# EAGLE schematic untitled (EAGLE 9.6.2)
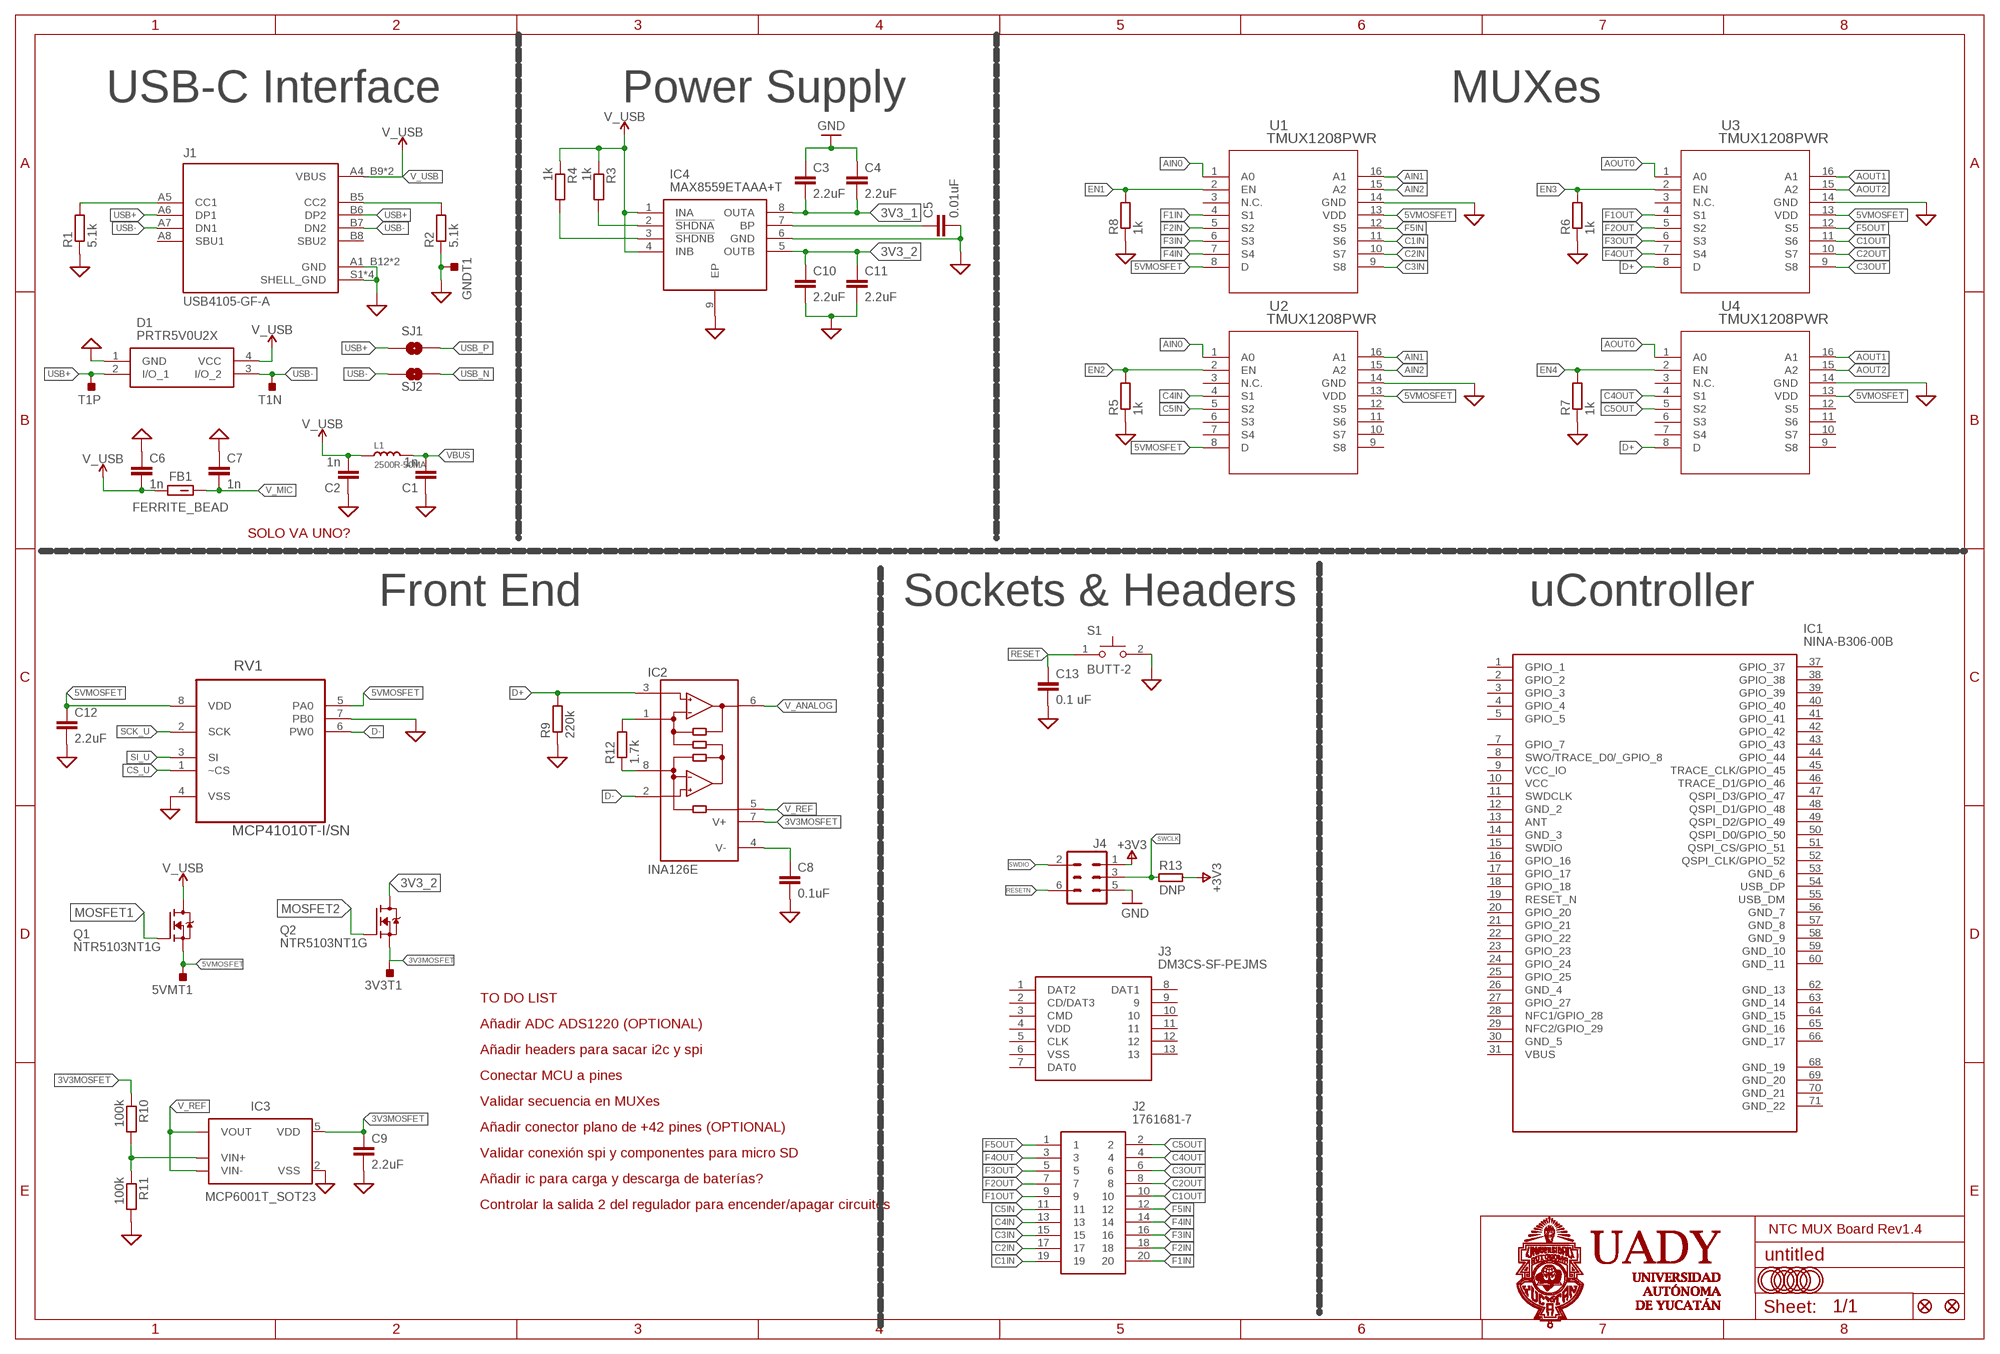
[diagram p0: schematic, sheet 1]

## Parts
3V3T1  TESTPOINT_TPS-SMD-10SN  [TESTPOINT_SMD-10SN]
5VMT1  TESTPOINT_TPS-SMD-10SN  [TESTPOINT_SMD-10SN]
C1  1n  C-EUC0603  [C0603]
C2  1n  C-EUC0603  [C0603]
C3  2.2uF  C-EUC0603  [C0603]
C4  2.2uF  C-EUC0603  [C0603]
C5  0.01uF  C-EUC0603  [C0603]
C6  1n  C-EUC0603  [C0603]
C7  1n  C-EUC0603  [C0603]
C8  0.1uF  C-EUC0603  [C0603]
C9  2.2uF  C-EUC0603  [C0603]
C10  2.2uF  C-EUC0603  [C0603]
C11  2.2uF  C-EUC0603  [C0603]
C12  2.2uF  C-EUC0603  [C0603]
C13  0.1 uF  C-EUC0603  [C0603]
D1  PRTR5V0U2X  [PRTR5V0U2X]
FB1  FERRITE_BEAD  FBCHIP-0603(1608-METRIC)  [BEADC1608X95N]
FID1  FIDUCIAL_1MM  [FIDUCIAL_1MM]
FID4  FIDUCIAL_1MM  [FIDUCIAL_1MM]
GNDT1  TESTPOINT_TPS-SMD-10SN  [TESTPOINT_SMD-10SN]
IC1  NINA-B306-00B  [NINAB30600B]
IC2  INA126E  [MSOP08]
IC3  MCP6001T_SOT23  [SOT95P280X145-5N]
IC4  MAX8559ETAAA+T  [SON65P300X300X80-9N]
J1  USB4105-GF-A  [GCT_USB4105-GF-A]
J2  1761681-7  [SHDR20W66P254_2X10_3302X883X92]
J3  DM3CS-SF-PEJMS  [DM3CSSFPEJMS]
J4  DNP  PINHD-2X03(NO4)  [2X03-TP1]
L1  2500R-50MA  SMD-FERRITE-BEAD-2500R-50MA(0603)  [L0603]
Q1  NTR5103NT1G  [SOT95P237X111-3N]
Q2  NTR5103NT1G  [SOT95P237X111-3N]
R1  5.1k  R-EU_R0603  [R0603]
R2  5.1k  R-EU_R0603  [R0603]
R3  1k  R-EU_R0603  [R0603]
R4  1k  R-EU_R0603  [R0603]
R5  1k  R-EU_R0603  [R0603]
R6  1k  R-EU_R0603  [R0603]
R7  1k  R-EU_R0603  [R0603]
R8  1k  R-EU_R0603  [R0603]
R9  220k  R-EU_R0603  [R0603]
R10  100k  R-EU_R0603  [R0603]
R11  100k  R-EU_R0603  [R0603]
R12  1.7k  R-EU_R0603  [R0603]
R13  DNP  R-DNP-0402  [0402-1005X55N]
RV1  MCP41010T-I/SN  [SOIC127P600X175-8N]
S1  BUTT-2  [SW_BUTT-2]
SJ1  JUMPER-SMT_2_NO_NO-SILK  [SMT-JUMPER_2_NO_NO-SILK]
SJ2  JUMPER-SMT_2_NO_NO-SILK  [SMT-JUMPER_2_NO_NO-SILK]
T1N  TESTPOINT_TPS-SMD-10SN  [TESTPOINT_SMD-10SN]
T1P  TESTPOINT_TPS-SMD-10SN  [TESTPOINT_SMD-10SN]
U1  TMUX1208PWR  [PW_16_TEX]
U2  TMUX1208PWR  [PW_16_TEX]
U3  TMUX1208PWR  [PW_16_TEX]
U4  TMUX1208PWR  [PW_16_TEX]
U$2  MOUNTINGHOLE2.5  [MOUNTINGHOLE_2.5_PLATED]
U$3  MOUNTINGHOLE2.5  [MOUNTINGHOLE_2.5_PLATED]
U$4  MOUNTINGHOLE2.5  [MOUNTINGHOLE_2.5_PLATED]
U$24  MOUNTINGHOLE2.5  [MOUNTINGHOLE_2.5_PLATED]

## Nets
3V3_1: C3.2 C4.2 IC4.8(OUTA)
3V3_2: C10.1 C11.1 IC4.5(OUTB) Q2.3(D)
3V3MOSFET: 3V3T1.TP C9.1 IC2.7(V+) IC3.5(VDD) Q2.2(S) R10.1
5VMOSFET: 5VMT1.TP C12.1 Q1.2(S) RV1.5(PA0) RV1.8(VDD) U1.8(D) U1.13(VDD) U2.8(D) U2.13(VDD) U3.13(VDD) U4.13(VDD)
+3V3: J4.1 R13.1
AIN0: U1.1(A0) U2.1(A0)
AIN1: U1.16(A1) U2.16(A1)
AIN2: U1.15(A2) U2.15(A2)
AOUT0: U3.1(A0) U4.1(A0)
AOUT1: U3.16(A1) U4.16(A1)
AOUT2: U3.15(A2) U4.15(A2)
C1IN: J2.19 U1.11(S6)
C1OUT: J2.10 U3.11(S6)
C2IN: J2.17 U1.10(S7)
C2OUT: J2.8 U3.10(S7)
C3IN: J2.15 U1.9(S8)
C3OUT: J2.6 U3.9(S8)
C4IN: J2.13 U2.4(S1)
C4OUT: J2.4 U4.4(S1)
C5IN: J2.11 U2.5(S2)
C5OUT: J2.2 U4.5(S2)
CS_U: RV1.1(~CS)
D+: IC2.3(+IN) R9.2 U3.8(D) U4.8(D)
D-: IC2.2(-IN) RV1.6(PW0)
EN1: R8.2 U1.2(EN)
EN2: R5.2 U2.2(EN)
EN3: R6.2 U3.2(EN)
EN4: R7.2 U4.2(EN)
F1IN: J2.20 U1.4(S1)
F1OUT: J2.9 U3.4(S1)
F2IN: J2.18 U1.5(S2)
F2OUT: J2.7 U3.5(S2)
F3IN: J2.16 U1.6(S3)
F3OUT: J2.5 U3.6(S3)
F4IN: J2.14 U1.7(S4)
F4OUT: J2.3 U3.7(S4)
F5IN: J2.12 U1.12(S5)
F5OUT: J2.1 U3.12(S5)
GND: C1.1 C2.1 C3.1 C4.1 C5.2 C6.1 C7.1 C8.2 C9.2 C10.2 C11.2 C12.2 C13.2 D1.1(GND) GNDT1.TP IC3.2(VSS) IC4.6(GND) IC4.9(EP) J1.A1_B12(GND) J1.B1_A12(GND) J1.S1(SHELL_GND) J1.S2(SHELL_GND) J1.S3(SHELL_GND) J1.S4(SHELL_GND) J4.5 R1.1 R2.1 R5.1 R6.1 R7.1 R8.1 R9.1 R11.2 RV1.4(VSS) RV1.7(PB0) S1.2 U1.14(GND) U2.14(GND) U3.14(GND) U4.14(GND) ; supply symbol labelled SUP
MOSFET1: Q1.1(G)
MOSFET2: Q2.1(G)
N$1: J1.A5(CC1) R1.2
N$2: IC4.2(!SHDNA) R3.2
N$3: IC4.3(!SHDNB) R4.2
N$4: IC2.1(RG) R12.2
N$5: C5.1 IC4.7(BP)
N$6: IC2.8(RG) R12.1
N$7: C8.1 IC2.4(V-)
N$8: J1.B5(CC2) R2.2
N$9: IC3.3(VIN+) R10.2 R11.1
RESET: C13.1 S1.1
RESETN: J4.6
SCK_U: RV1.2(SCK)
SI_U: RV1.3(SI)
SWCLK: J4.3 R13.2
SWDIO: J4.2
USB+: D1.2(I/O_1) J1.A6(DP1) J1.B6(DP2) SJ1.1 T1P.TP
USB-: D1.3(I/O_2) J1.A7(DN1) J1.B7(DN2) SJ2.1 T1N.TP
USB_N: SJ2.2
USB_P: SJ1.2
V_ANALOG: IC2.6(OUT)
V_MIC: C7.2 FB1.2
V_REF: IC2.5(REF) IC3.1(VOUT) IC3.4(VIN-)
V_USB: C2.2 C6.2 D1.4(VCC) FB1.1 IC4.1(INA) IC4.4(INB) J1.A4_B9(VBUS) J1.B4_A9(VBUS) L1.1 Q1.3(D) R3.1 R4.1
VBUS: C1.2 L1.2
Unconnected: IC1.1(GPIO_1) IC1.2(GPIO_2) IC1.3(GPIO_3) IC1.4(GPIO_4) IC1.5(GPIO_5) IC1.7(GPIO_7) IC1.8(SWO/TRACE_D0/_GPIO_8) IC1.9(VCC_IO) IC1.10(VCC) IC1.11(SWDCLK) IC1.12(GND_2) IC1.13(ANT) IC1.14(GND_3) IC1.15(SWDIO) IC1.16(GPIO_16) IC1.17(GPIO_17) IC1.18(GPIO_18) IC1.19(RESET_N) IC1.20(GPIO_20) IC1.21(GPIO_21) IC1.22(GPIO_22) IC1.23(GPIO_23) IC1.24(GPIO_24) IC1.25(GPIO_25) IC1.26(GND_4) IC1.27(GPIO_27) IC1.28(NFC1/GPIO_28) IC1.29(NFC2/GPIO_29) IC1.30(GND_5) IC1.31(VBUS) IC1.37(GPIO_37) IC1.38(GPIO_38) IC1.39(GPIO_39) IC1.40(GPIO_40) IC1.41(GPIO_41) IC1.42(GPIO_42) IC1.43(GPIO_43) IC1.44(GPIO_44) IC1.45(TRACE_CLK/GPIO_45) IC1.46(TRACE_D1/GPIO_46) IC1.47(QSPI_D3/GPIO_47) IC1.48(QSPI_D1/GPIO_48) IC1.49(QSPI_D2/GPIO_49) IC1.50(QSPI_D0/GPIO_50) IC1.51(QSPI_CS/GPIO_51) IC1.52(QSPI_CLK/GPIO_52) IC1.53(GND_6) IC1.54(USB_DP) IC1.55(USB_DM) IC1.56(GND_7) IC1.57(GND_8) IC1.58(GND_9) IC1.59(GND_10) IC1.60(GND_11) IC1.62(GND_13) IC1.63(GND_14) IC1.64(GND_15) IC1.65(GND_16) IC1.66(GND_17) IC1.68(GND_19) IC1.69(GND_20) IC1.70(GND_21) IC1.71(GND_22) J1.A8(SBU1) J1.B8(SBU2) J3.1(DAT2) J3.2(CD/DAT3) J3.3(CMD) J3.4(VDD) J3.5(CLK) J3.6(VSS) J3.7(DAT0) J3.8(DAT1) J3.9 J3.10 J3.11 J3.12 J3.13 U1.3(N.C.) U2.3(N.C.) U2.6(S3) U2.7(S4) U2.9(S8) U2.10(S7) U2.11(S6) U2.12(S5) U3.3(N.C.) U4.3(N.C.) U4.6(S3) U4.7(S4) U4.9(S8) U4.10(S7) U4.11(S6) U4.12(S5)

## Notes on the sheet
- USB-C Interface | Power Supply | MUXes
- SOLO VA UNO?
- Front End | Sockets & Headers | uController
- TO DO LIST
- Añadir ADC ADS1220 (OPTIONAL)
- Añadir headers para sacar i2c y spi
- Conectar MCU a pines
- Validar secuencia en MUXes
- Añadir conector plano de +42 pines (OPTIONAL)
- Validar conexión spi y componentes para micro SD
- Añadir ic para carga y descarga de baterías?
- Controlar la salida 2 del regulador para encender/apagar circuitos
- NTC MUX Board Rev1.4

## Library data of the parts
3V3T1 5VMT1 GNDT1 T1N T1P = 52101-101-REV-A_v16:TESTPOINT_TPS: TEST POINT PAD; BOM: EXCLUDE
C1-C13 = rcl:C-EU: CAPACITOR, European symbol; SPICEPREFIX: C
D1 = PRTR5V0U2X:PRTR5V0U2X: NEXPERIA - PRTR5V0U2X - DIODE, TVS, DUAL, SOT-143B Source: Datasheet <https://assets.nexperia.com/documents/data-sheet/PRTR5V0U2X.pdf>; DESCRIPTION: NEXPERIA - PRTR5V0U2X - DIODE, TVS, DUAL, SOT-143B; HEIGHT: 1.1mm; MANUFACTURER_NAME: Nexperia; MANUFACTURER_PART_NUMBER: PRTR5V0U2X; MOUSER_PART_NUMBER: N/A; MOUSER_PRICE-STOCK: https://www.mouser.co.uk/ProductDetail/Nexperia/PRTR5V0U2X?qs=vHuUswq2%252BsxqVTVM0kNyWw%3D%3D
FB1 = Filter:FB: Ferrite Bead - Generic; CATEGORY: Filter; SUB-CATEGORY: Ferrite bead
FID1 FID4 = microbuilder:FIDUCIAL: Fiducial Alignment Points Various fiducial points for machine vision alignment.; BOM: EXCLUDE
IC1 = NINA-B306-00B:NINA-B306-00B: RX TXRX MODULE BT TRC ANT SMD Source: Datasheet <https://www.u-blox.com/en/docs/UBX-17052099>; DESCRIPTION: RX TXRX MODULE BT TRC ANT SMD; HEIGHT: 2.63mm; MANUFACTURER_NAME: U-Blox; MANUFACTURER_PART_NUMBER: NINA-B306-00B; MOUSER_PART_NUMBER: 377-NINA-B306-00B; MOUSER_PRICE-STOCK: https://www.mouser.co.uk/ProductDetail/u-blox/NINA-B306-00B?qs=zW32dvEIR3uPiIbgcFbQtQ%3D%3D
IC2 = INA126:INA126: Instrumentation Amplifier Micropower, Single and Dual Versions Check availability <https://pricing.snapeda.com/parts/INA126/Texas%20Instruments/view-part?ref=eda>; AVAILABILITY: In Stock; DESCRIPTION: Instrumentation Amplifier 1 Circuit - 8-VSSOP; MF: Texas Instruments; MP: INA126; PACKAGE: - Texas Instruments; PRICE: None; PURCHASE-URL: https://pricing.snapeda.com/search/part/INA126/?ref=eda
IC3 = IC_Linear:MCP6001T: Low-Power Operational Amplifier Reference Datasheet <https://ww1.microchip.com/downloads/en/DeviceDoc/MCP6001-1R-1U-2-4-1-MHz-Low-Power-Op-Amp-DS20001733L.pdf>; CATEGORY: Amplifier; DESCRIPTION: Low-Power Operational Amplifier; MANUFACTURER: Microchip Technology; MPN: Generic; SERIES: MCP6001; SUB-CATEGORY: OpAmp
IC4 = MAX8559ETAAA+T:MAX8559ETAAA+T: LDO Voltage Regulators Dual 300mA Low-Noise Linear Regulator Source: Datasheet <https://datasheets.maximintegrated.com/en/ds/MAX8559.pdf>; ARROW_PART_NUMBER: MAX8559ETAAA+T; ARROW_PRICE-STOCK: https://www.arrow.com/en/products/max8559etaaat/maxim-integrated?region=nac; DESCRIPTION: LDO Voltage Regulators Dual 300mA Low-Noise Linear Regulator; HEIGHT: 0.8mm; MANUFACTURER_NAME: Maxim Integrated; MANUFACTURER_PART_NUMBER: MAX8559ETAAA+T; MOUSER_PART_NUMBER: 700-MAX8559ETAAAT; MOUSER_PRICE-STOCK: https://www.mouser.co.uk/ProductDetail/Maxim-Integrated/MAX8559ETAAA%2bT?qs=Jw2w9zrI6w82U2vO8NRcoQ%3D%3D
J1 = USB4105-GF-A:USB4105-GF-A: USB-C (USB TYPE-C) USB 2.0 Receptacle Connector 24 (16+8 Dummy) Position Surface Mount, Right Angle; Through Hole Check availability <https://pricing.snapeda.com/parts/USB4105-GF-A/GCT/view-part?ref=eda>; AVAILABILITY: In Stock; DESCRIPTION: USB-C (USB TYPE-C) USB 2.0 Receptacle Connector 24 (16+8 Dummy) Position Surface Mount, Right Angle; Through Hole; MF: GCT; MP: USB4105-GF-A; PACKAGE: None; PRICE: None; PURCHASE-URL: https://pricing.snapeda.com/search/part/USB4105-GF-A/?ref=eda
J2 = 1761681-7:1761681-7: 2.54mm,Header,vert,DR,20W,lo profile,Au Source: Datasheet <https://datasheet.datasheetarchive.com/originals/dk/DKDS-21/401441.pdf>; ARROW_PART_NUMBER: 1761681-7; ARROW_PRICE-STOCK: https://www.arrow.com/en/products/1761681-7/te-connectivity?region=nac; DESCRIPTION: 2.54mm,Header,vert,DR,20W,lo profile,Au; HEIGHT: 9.22mm; MANUFACTURER_NAME: TE Connectivity; MANUFACTURER_PART_NUMBER: 1761681-7; MOUSER_PART_NUMBER: 571-1761681-7; MOUSER_PRICE-STOCK: https://www.mouser.co.uk/ProductDetail/TE-Connectivity/1761681-7?qs=xbX7sCn4AeOgS8GR6bHZNw%3D%3D
J3 = DM3CS-SF-PEJMS:DM3CS-SF-PEJMS: Memory Card Connectors 8P R/A SMT MICRO SD HINGE PUSH-PULL Source: Datasheet; DESCRIPTION: Memory Card Connectors 8P R/A SMT MICRO SD HINGE PUSH-PULL; HEIGHT: 1.83mm; MANUFACTURER_NAME: Hirose; MANUFACTURER_PART_NUMBER: DM3CS-SF-PEJMS
J4 = Arduino-connectors:PINHD-2X03(NO4): PIN HEADER; CODE-ARDUINO: DNP; DATASHEET: DNP; DISTRIBUTOR-LINK: DNP; DISTRIBUTOR-PN: DNP; MANUFACTURER: DNP; MANUFACTURER-PN: DNP
L1 = OPL_Ferrite_and_Magnetic_Bead:SMD-FERRITE-BEAD-2500R-50MA(0603): 303030020
Q1 Q2 = NTR5103NT1G:NTR5103NT1G: Small Signal MOSFET 60V 310mA 2.5mOhm Single N-Channel SOT-23 Small Signal MOSFET Check availability <https://pricing.snapeda.com/parts/NTR5103NT1G/ON%20Semiconductor/view-part?ref=eda>; AVAILABILITY: In Stock; DESCRIPTION: N-Channel 60 V 260mA (Ta) 300mW (Ta) Surface Mount SOT-23-3 (TO-236); MF: ON Semiconductor; MP: NTR5103NT1G; PACKAGE: SOT-23-3 Motorola; PRICE: None; PURCHASE-URL: https://pricing.snapeda.com/search/part/NTR5103NT1G/?ref=eda
R1-R12 = rcl:R-EU_: RESISTOR, European symbol; SPICEPREFIX: R
R13 = Arduino-rcl:R: SMD Resistor; CODE-ARDUINO: DNP; DATASHEET: DNP; DISTRIBUTOR-LINK: DNP; DISTRIBUTOR-PN: DNP; MANUFACTURER: DNP; MANUFACTURER-PN: DNP; NOTE: NO
RV1 = MCP41010T-I_SN:MCP41010T-I/SN: Digital potentiometer Check availability <https://pricing.snapeda.com/parts/MCP41010T-I/SN/Microchip%20Technology/view-part?ref=eda>; AVAILABILITY: In Stock; DESCRIPTION: Digital Potentiometer 10k Ohm 1 Circuit 256 Taps SPI Interface 8-SOIC; MF: Microchip Technology; MP: MCP41010T-I/SN; PACKAGE: SOIC-8 Microchip; PRICE: None; PURCHASE-URL: https://pricing.snapeda.com/search/part/MCP41010T-I/SN/?ref=eda
S1 = BUTT-2:BUTT-2: Tactile Switches MINI PUSH BUTTON SWITCH 2-PIN QTY. 4 Check availability <https://pricing.snapeda.com/parts/BUTT-2/Gravitech/view-part?ref=eda>; AVAILABILITY: In Stock; DESCRIPTION: Tactile Switches MINI PUSH BUTTON SWITCH 2-PIN QTY. 4; MF: Gravitech; MP: BUTT-2; PACKAGE: None; PRICE: None; PURCHASE-URL: https://pricing.snapeda.com/search/part/BUTT-2/?ref=eda
SJ1 SJ2 = SparkFun-Jumpers:JUMPER-SMT_2_NO: Normally open jumper This jumper has two pads in close proximity to each other. Apply solder to close the connection. Round pads are easier to solder for beginners, but are a lot larger. SparkFun Product that uses the round pads: SparkFun EL Sequencer <https://www.sparkfun.com/products/12781>
U1-U4 = TMUX1208:TMUX1208PWR; COPYRIGHT: Copyright (C) 2022 Ultra Librarian. All rights reserved.; MANUFACTURER_PART_NUMBER: TMUX1208PWR; MFR_NAME: Texas Instruments
U$2-U$4 U$24 = microbuilder:MOUNTINGHOLE: Mounting Hole For #2 screws (0.086"/2.18mm width, 0.094"/2.4mm hole) use 2.5mm